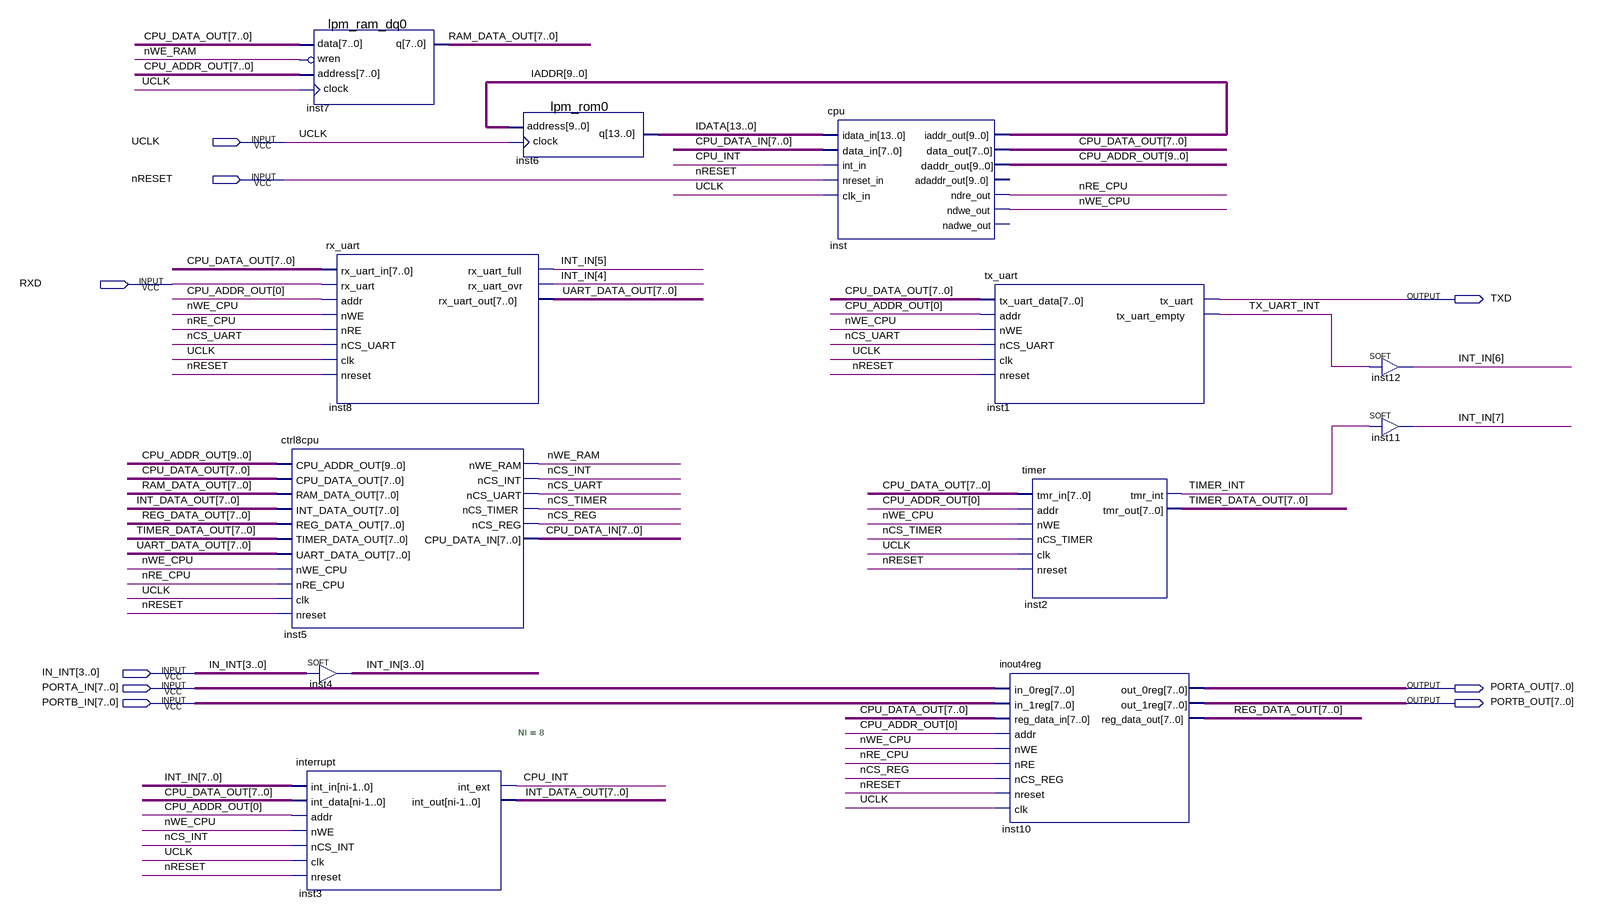
[diagram p0: schematic sheet]
// Quartus schematic Cpu8Bit.bdf as structural Verilog: 12 symbols, 9 pins
module Cpu8Bit (
  input  UCLK,
  input  nRESET,
  input  RXD,
  input  [3:0] IN_INT,
  input  [7:0] PORTA_IN,
  input  [7:0] PORTB_IN,
  output TXD,
  output [7:0] PORTA_OUT,
  output [7:0] PORTB_OUT
);

  wire CPU_INT, nCS_INT, nCS_REG, nCS_TIMER, nCS_UART, nRE_CPU, nWE_CPU, nWE_RAM, TIMER_INT, TX_UART_INT;
  wire [7:0] CPU_DATA_IN, CPU_DATA_OUT, INT_DATA_OUT, INT_IN, RAM_DATA_OUT, REG_DATA_OUT, TIMER_DATA_OUT,
       UART_DATA_OUT;
  wire [9:0] CPU_ADDR_OUT, IADDR;
  wire [13:0] IDATA;

  ctrl8cpu inst5 (
    .CPU_ADDR_OUT(CPU_ADDR_OUT), .CPU_DATA_OUT(CPU_DATA_OUT), .RAM_DATA_OUT(RAM_DATA_OUT),
    .INT_DATA_OUT(INT_DATA_OUT), .REG_DATA_OUT(REG_DATA_OUT), .TIMER_DATA_OUT(TIMER_DATA_OUT),
    .UART_DATA_OUT(UART_DATA_OUT), .nWE_CPU(nWE_CPU), .nRE_CPU(nRE_CPU), .clk(UCLK), .nreset(nRESET),
    .nWE_RAM(nWE_RAM), .nCS_INT(nCS_INT), .nCS_UART(nCS_UART), .nCS_TIMER(nCS_TIMER), .nCS_REG(nCS_REG),
    .CPU_DATA_IN(CPU_DATA_IN));
  lpm_ram_dq0 inst7 (.data(CPU_DATA_OUT), .wren(~nWE_RAM), .address(CPU_ADDR_OUT[7:0]), .clock(UCLK), .q(RAM_DATA_OUT));
  rx_uart inst8 (
    .rx_uart_in(CPU_DATA_OUT), .rx_uart(RXD), .addr(CPU_ADDR_OUT[0]), .nWE(nWE_CPU), .nRE(nRE_CPU),
    .nCS_UART(nCS_UART), .clk(UCLK), .nreset(nRESET), .rx_uart_full(INT_IN[5]), .rx_uart_ovr(INT_IN[4]),
    .rx_uart_out(UART_DATA_OUT));
  SOFT inst4[3:0] (.IN(IN_INT), .OUT(INT_IN[3:0]));
  interrupt #(.NI(8)) inst3 (
    .int_in(INT_IN), .int_data(CPU_DATA_OUT), .addr(CPU_ADDR_OUT[0]), .nWE(nWE_CPU), .nCS_INT(nCS_INT),
    .clk(UCLK), .nreset(nRESET), .int_ext(CPU_INT), .int_out(INT_DATA_OUT));
  lpm_rom0 inst6 (.address(IADDR), .clock(UCLK), .q(IDATA));
  cpu inst (
    .idata_in(IDATA), .data_in(CPU_DATA_IN), .int_in(CPU_INT), .nreset_in(nRESET), .clk_in(UCLK),
    .iaddr_out(IADDR), .data_out(CPU_DATA_OUT), .daddr_out(CPU_ADDR_OUT), .ndre_out(nRE_CPU),
    .ndwe_out(nWE_CPU));  // open: adaddr_out, nadwe_out
  tx_uart inst1 (
    .tx_uart_data(CPU_DATA_OUT), .addr(CPU_ADDR_OUT[0]), .nWE(nWE_CPU), .nCS_UART(nCS_UART), .clk(UCLK),
    .nreset(nRESET), .tx_uart(TXD), .tx_uart_empty(TX_UART_INT));
  inout4reg inst10 (
    .in_0reg(PORTA_IN), .in_1reg(PORTB_IN), .reg_data_in(CPU_DATA_OUT), .addr(CPU_ADDR_OUT[0]),
    .nWE(nWE_CPU), .nRE(nRE_CPU), .nCS_REG(nCS_REG), .nreset(nRESET), .clk(UCLK), .out_0reg(PORTA_OUT),
    .out_1reg(PORTB_OUT), .reg_data_out(REG_DATA_OUT));
  timer inst2 (
    .tmr_in(CPU_DATA_OUT), .addr(CPU_ADDR_OUT[0]), .nWE(nWE_CPU), .nCS_TIMER(nCS_TIMER), .clk(UCLK),
    .nreset(nRESET), .tmr_int(TIMER_INT), .tmr_out(TIMER_DATA_OUT));
  SOFT inst12 (.IN(TX_UART_INT), .OUT(INT_IN[6]));
  SOFT inst11 (.IN(TIMER_INT), .OUT(INT_IN[7]));
endmodule
